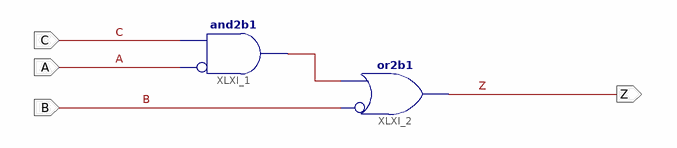
[diagram p0: schematic sheet 1]
// Xilinx ISE schematic p1ej3a.sch (spartan3) as structural Verilog: 2 symbols, 4 ports
module p1ej3a (
  input  C,
  input  A,
  input  B,
  output Z
);

  wire XLXN_2;

  and XLXI_1 (XLXN_2, ~A, C);  // and2b1
  or XLXI_2 (Z, ~B, XLXN_2);  // or2b1
endmodule
